# Altium schematic sheet usb.SchDoc
size A
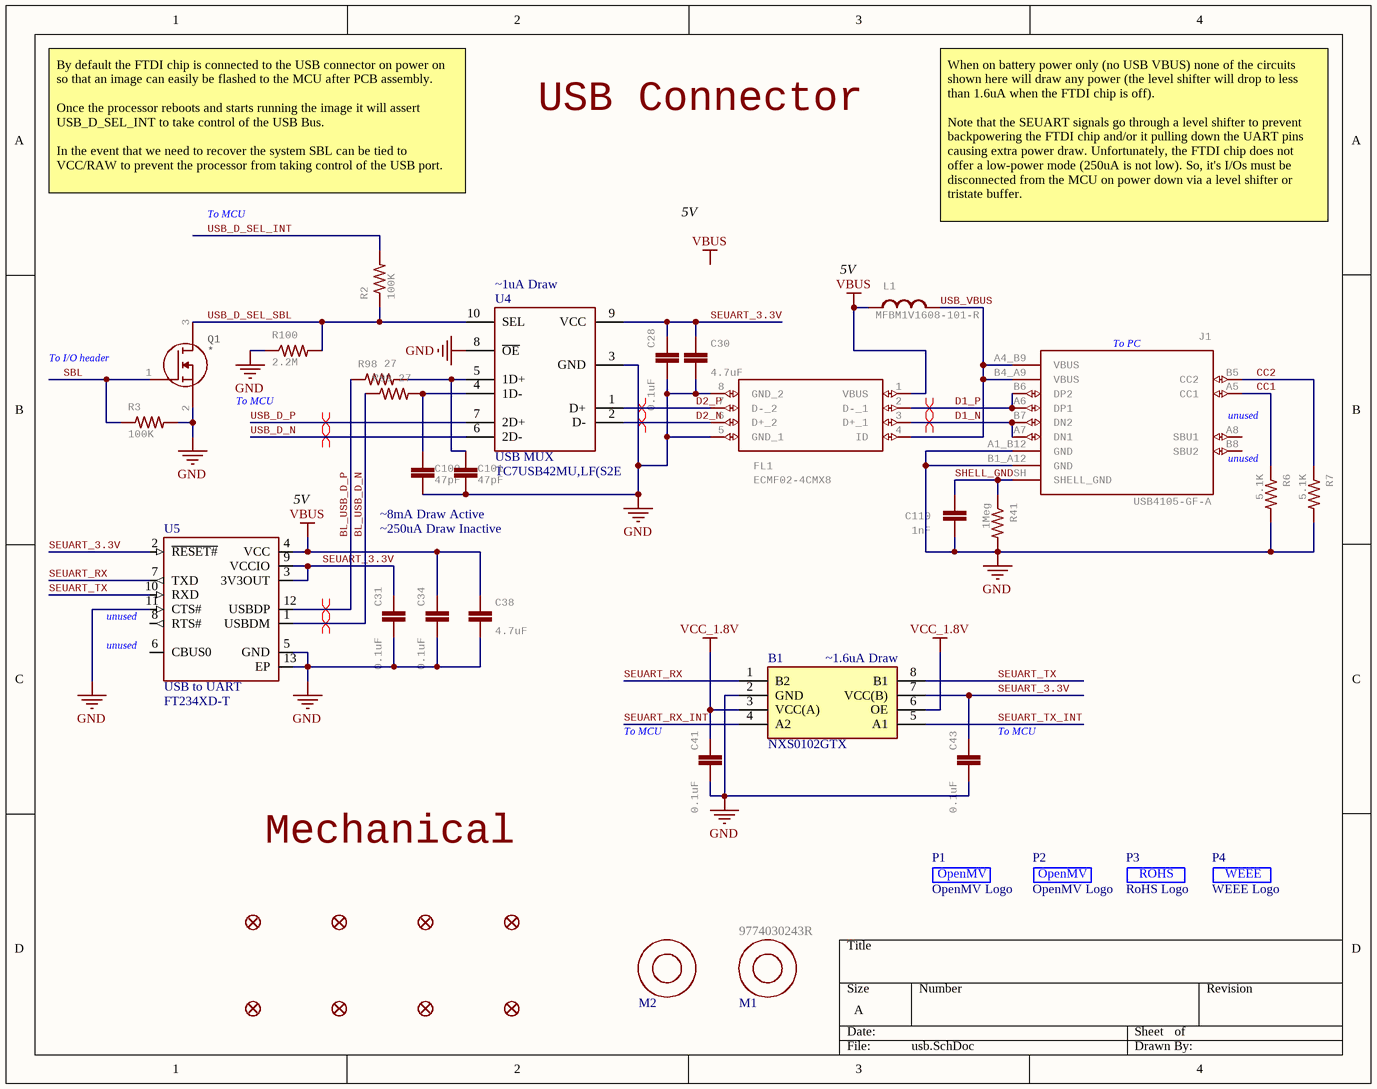
[diagram p0: usb.SchDoc]

## Parts
B1  NXS0102GTX  [NXS0102GTX]
C28  0.1uF  [0402-CAP]
C30  4.7uF  [0402-CAP]
C31  0.1uF  [0402-CAP]
C34  0.1uF  [0402-CAP]
C38  4.7uF  [0402-CAP]
C41  0.1uF  [0402-CAP]
C43  0.1uF  [0402-CAP]
C100  47pF  [C0201]
C101  47pF  [C0201]
C110  1nF  [0402-CAP]
FD1  FIDUCIAL1X2  [FIDUCIAL-1X2]  (value not drawn)
FD2  FIDUCIAL1X2  [FIDUCIAL-1X2]  (value not drawn)
FD3  FIDUCIAL1X2  [FIDUCIAL-1X2]  (value not drawn)
FD4  FIDUCIAL1X2  [FIDUCIAL-1X2]  (value not drawn)
FD5  FIDUCIAL1X2  [FIDUCIAL-1X2]  (value not drawn)
FD6  FIDUCIAL1X2  [FIDUCIAL-1X2]  (value not drawn)
FD7  FIDUCIAL1X2  [FIDUCIAL-1X2]  (value not drawn)
FD8  FIDUCIAL1X2  [FIDUCIAL-1X2]  (value not drawn)
FL1  ECMF02-4CMX8  [ECMF024CMX8]
J1  USB4105-GF-A  [GCT_USB4105-GF-A]
L1  MFBM1V1608-101-R  [0603-RES]
M1  9774030243R  [9774030243R]
M2  9774030243R  [9774030243R]  (value not drawn)
P1  OpenMV Logo  [OMV-LOGO-SMALL]  (no BOM)
P2  OpenMV Logo  [OMV-LOGO-SMALL]  (no BOM)
P3  RoHS Logo  [ROHS]  (no BOM)
P4  WEEE Logo  [WEEE]  (no BOM)
Q1  NMOS  [DFN1006]  (value not drawn)
R2  100K  [R0201]
R3  100K  [R0201]
R6  5.1K  [0402-RES]
R7  5.1K  [0402-RES]
R41  1Meg  [0402-RES]
R98  27  [R0201]
R99  27  [R0201]
R100  2.2M  [R0201]
U4  USB MUX  [TC7USB42MU,LF(S2E]
U5  USB to UART  [SON45P300X300X80-13N]

## Nets
GND: B1.2(GND) C28.2 C30.1 C31.2 C34.2 C38.1 C41.2 C43.2 C100.1 C101.1 C110.2 FL1.5(GND_1) FL1.8(GND_2) J1.A1_B12(GND) J1.B1_A12(GND) Q1.2(S) R3.2 R6.2 R7.2 R41.2 R100.1 U4.3(GND) U4.8(~{OE}) U5.5(GND) U5.11(CTS#) U5.13(EP)
VBUS: C34.1 C38.2 FL1.1(VBUS) L1.1 U5.4(VCC)
VCC_1.8V: B1.3(VCC(A)) B1.6(OE) C41.1
BL_USB_D_N: R99.1 U5.1(USBDM)
BL_USB_D_P: R98.1 U5.12(USBDP)
CC1: J1.A5(CC1) R6.1
CC2: J1.B5(CC2) R7.1
D1_N: FL1.3(D+_1) J1.A7(DN1) J1.B7(DN2)
D1_P: FL1.2(D-_1) J1.A6(DP1) J1.B6(DP2)
D2_N: FL1.6(D+_2) U4.2(D-)
D2_P: FL1.7(D-_2) U4.1(D+)
SBL: Q1.1(G) R3.1
SEUART_3.3V: B1.7(VCC(B)) C28.1 C30.2 C31.1 C43.1 U4.9(VCC) U5.2(~{RESET#}) U5.3(3V3OUT) U5.9(VCCIO)
SEUART_RX: B1.1(B2) U5.7(TXD)
SEUART_RX_INT: B1.4(A2)
SEUART_TX: B1.8(B1) U5.10(RXD)
SEUART_TX_INT: B1.5(A1)
SHELL_GND: C110.1 J1.SH(SHELL_GND) R41.1
USB_D_N: U4.6(2D-)
USB_D_P: U4.7(2D+)
USB_D_SEL_INT: R2.2
USB_D_SEL_SBL: Q1.3(D) R2.1 R100.2 U4.10(SEL)
USB_VBUS: FL1.4(ID) J1.A4_B9(VBUS) J1.B4_A9(VBUS) L1.2
NetC100_2: C100.2 R99.2 U4.4(1D-)
NetC101_2: C101.2 R98.2 U4.5(1D+)

Not connected (* = marked no-connect by the designer): J1 A8(SBU1) B8(SBU2); U5 6(CBUS0) 8(RTS#)

## Layout directives
differential pair: BL_USB_D_N, BL_USB_D_P, D1_N, D1_P, D2_N, D2_P, USB_D_N, USB_D_P

## Notes on the sheet
- USB Connector
- By default the FTDI chip is connected to the USB connector on power on so that an image can easily be flashed to the MCU after PCB assembly.
  Once the processor reboots and starts running the image it will assert USB_D_SEL_INT to take control of the USB Bus.
  In the event that we need to recover the system SBL can be tied to VCC/RAW to prevent the processor from taking control of the USB port.
- To MCU
- 5V
- When on battery power only (no USB VBUS) none of the circuits shown here will draw any power (the level shifter will drop to less than 1.6uA when the FTDI chip is off).
  Note that the SEUART signals go through a level shifter to prevent backpowering the FTDI chip and/or it pulling down the UART pins causing extra power draw. Unfortunately, the FTDI chip does not offer a low-power mode (250uA is not low). So, it's I/Os must be disconnected from the MCU on power down via a level shifter or tristate buffer.
- (near U4) ~1uA Draw
- (near L1) 5V
- To I/O header
- (near J1) To PC
- unused
- (near J1) unused
- (near U5) 5V
- ~250uA Draw Inactive
- ~8mA Draw Active
- (near U5) unused
- (near B1) ~1.6uA Draw
- (near C41) To MCU
- (near C43) To MCU
- Mechanical
- Labels drawn without touching a wire or pin: VBUS
- (in symbol OMV) OpenMV

## Library data of the parts
B1 = NXS0102GTX: Dual supply translating transceiver; open drain; auto direction sensing; Manufacturer_Name: Nexperia; Geometry.Height: 0.5mm; Mouser Part Number: 771-NXS0102GTX; Mouser Price/Stock: https://www.mouser.co.uk/ProductDetail/Nexperia/NXS0102GTX?qs=GBLSl2AkirukzzJX55VgJA%3D%3D; Manufacturer_Part_Number: NXS0102GTX; Datasheet Link: https://assets.nexperia.com/documents/data-sheet/NXS0102.pdf
C28 C31 C34 C41 C43 = C-EUC0201: CAPACITOR, European symbol; MPN: C0402C104Z4VAC; GateName_1: G$1; SymbolName_1: C-EU; POPULARITY: 0; LibraryName: rcl; DeviceSetName: C-EU; SPICEPREFIX: C; Part Number: C0402C104Z4VAC
C30 C38 = CAP0402-CAP: CapacitorStandard 0603 ceramic capacitor, and 0.1" leaded capacitor.; MPN: JMK105BBJ475MV-F; GateName_1: G$1; SymbolName_1: CAP; DeviceName: 0402-CAP; LibraryName: sfe; DeviceSetName: CAP; Part Number: JMK105BBJ475MV-F
C100 C101 = C-EUC0201: CAPACITOR, European symbol; GateName_1: G$1; SymbolName_1: C-EU; POPULARITY: 0; DeviceName: C0201; SPICEPREFIX: C
C110 = CAP0402-CAP: Capacitor; MPN: VJ0402Y102JXACW1BC; GateName_1: G$1; SymbolName_1: CAP; DeviceName: 0402-CAP; LibraryName: sfe; DeviceSetName: CAP; Part Number: VJ0402Y102JXACW1BC
FD1-FD8 = FIDUCIAL1X2: Fiducial Alignment Points    Point-of-reference for pick-and-place machines and other optical instruments.; GateName_1: G$1; DeviceName: 1X2; SymbolName_1: FIDUCIAL; LibraryName: SparkFun-Aesthetics; DeviceSetName: FIDUCIAL
FL1 = ECMF02-4CMX8: Common Mode Filter & ESD Prot. USB uQFN8 STMicroelectronics ECMF02 Series, Signal Filter uQFN SMD, Flat Contact Termination, 2.6 x 1.3 x 0.6mm   Source:  Datasheet; GateName_1: G$1; SymbolName_1: ECMF02-4CMX8; LibraryName: ECMF02-4CMX8; DeviceSetName: ECMF02-4CMX8; HEIGHT: mm; MANUFACTURER_NAME: STMicroelectronics; MANUFACTURER_PART_NUMBER: ECMF02-4CMX8; MOUSER_PART_NUMBER: 511-ECMF02-4CMX8; MOUSER_PRICE-STOCK: https://www.mouser.co.uk/ProductDetail/STMicroelectronics/ECMF02-4CMX8?qs=xYt8xtm2zhmK7GoDlDZR3A%3D%3D; MPN: ECMF02-4CMX8; Part Number: ECMF02-4CMX8
J1 = USB4105-GF-A: USB-C (USB TYPE-C) USB 2.0 Receptacle Connector 24 (16+8 Dummy) Position Surface Mount, Right Angle; Through Hole  Check availability; GateName_1: G$1; MF: GCT; SymbolName_1: USB4105-GF-A; LibraryName: USB4105-GF-A; DeviceSetName: USB4105-GF-A; AVAILABILITY: In Stock; MP: USB4105-GF-A; MPN: USB4105-GF-A; PACKAGE: None; PRICE: None; PURCHASE-URL: https://pricing.snapeda.com/search/part/USB4105-GF-A/?ref=eda; Part Number: USB4105-GF-A
L1 = INDUCTOR: InductorsBasic Inductor/Choke - 0603 and 1206. Footprints are not proven and vary greatly between part numbers.; GateName_1: G$1; MPN: MFBM1V1608-101-R; Part Number: MFBM1V1608-101-R
M1 M2 = 9774030243R: M2 3mm Standoff; GateName_1: G$1; SymbolName_1: 9774030243R; LibraryName: 9774030243R; DeviceSetName: 9774030243R; MPN: 9774030243R; Part Number: 9774030243R
P1 P2 = OMV
P3 = ROHS
P4 = WEEE
R2 R3 R98-R100 = RESISTOR0402-RES: GateName_1: G$1; SymbolName_1: RESISTOR; LibraryName: sfe; DeviceSetName: RESISTOR
  R2 R3 R100: DeviceName: 0402-RES
R6 R7 = RESISTOR0402-RES: ResistorBasic schematic elements and footprints for 0603, 1206, and PTH resistors.; MPN: RC0402JR-075K1L; GateName_1: G$1; SymbolName_1: RESISTOR; DeviceName: 0402-RES; LibraryName: sfe; DeviceSetName: RESISTOR; Part Number: RC0402JR-075K1L
R41 = RESISTOR0402-RES: Resistor; MPN: CRCW04021M00FKEDC; GateName_1: G$1; SymbolName_1: RESISTOR; DeviceName: 0402-RES; LibraryName: sfe; DeviceSetName: RESISTOR; Part Number: CRCW04021M00FKEDC
U4 = TC7USB42MU,LF(S2E: MF: Toshiba; MPN: TC7USB42MU,LF(S2E
U5 = FT234XD-T: USB Bridge, USB to UART USB 2.0 UART Interface 12-DFN _3x3_; MF: FTDI,; Part Number: FT234XD-T; MPN: FT234XD-T
Q1 = NMOS: MPN: *